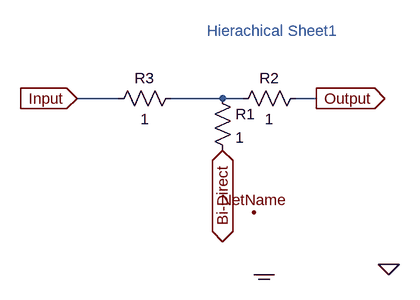
[diagram p0: schematic Hierarchical.asc]
Hierarchical.asc, the LTspice schematic file:
Version 4.1
SHEET 1 880 680
WIRE -64 240 -128 240
WIRE 96 240 16 240
WIRE 128 240 96 240
WIRE 240 240 208 240
FLAG -128 240 Input
IOPIN -128 240 In
FLAG 240 240 Output
IOPIN 240 240 Out
FLAG 96 320 Bi-Direct
IOPIN 96 320 BiDir
FLAG 144 416 NetName
FLAG 352 496 0
FLAG 160 512 COM
SYMBOL res 80 224 R0
SYMATTR InstName R1
SYMATTR Value 1
SYMBOL res 224 224 R90
WINDOW 0 0 56 VBottom 2
WINDOW 3 32 56 VTop 2
SYMATTR InstName R2
SYMATTR Value 1
SYMBOL res 32 224 R90
WINDOW 0 0 56 VBottom 2
WINDOW 3 32 56 VTop 2
SYMATTR InstName R3
SYMATTR Value 1
TEXT 72 136 Left 2 ;Hierachical Sheet1

The netlist it stands for:
* Hierarchical.asc
R1 N001 Bi-Direct 1
R2 Output N001 1
R3 N001 Input 1
* Hierachical Sheet1
.backanno
.end